# EAGLE schematic logic_level_converter_BSS138 (EAGLE 6.4)
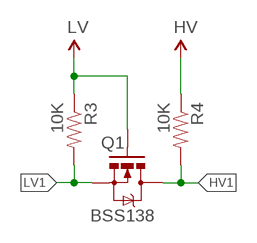
[diagram p0: schematic, sheet 1]

## Parts
Q1  BSS138  MOSFET-NCHANNELSMD  [SOT23-3]
R3  10K  RESISTOR0603-RES  [0603-RES]
R4  10K  RESISTOR0603-RES  [0603-RES]

## Nets
HV: R4.1
HV1: Q1.3(D) R4.2
LV: Q1.1(G) R3.1
LV1: Q1.2(S) R3.2

## Library data of the parts
Q1 = SparkFun:MOSFET-NCHANNEL
R3 R4 = SparkFun:RESISTOR: Resistor Basic schematic elements and footprints for 0603, 1206, and PTH resistors.